# EAGLE schematic ws2812b-board (EAGLE 6.5.0)
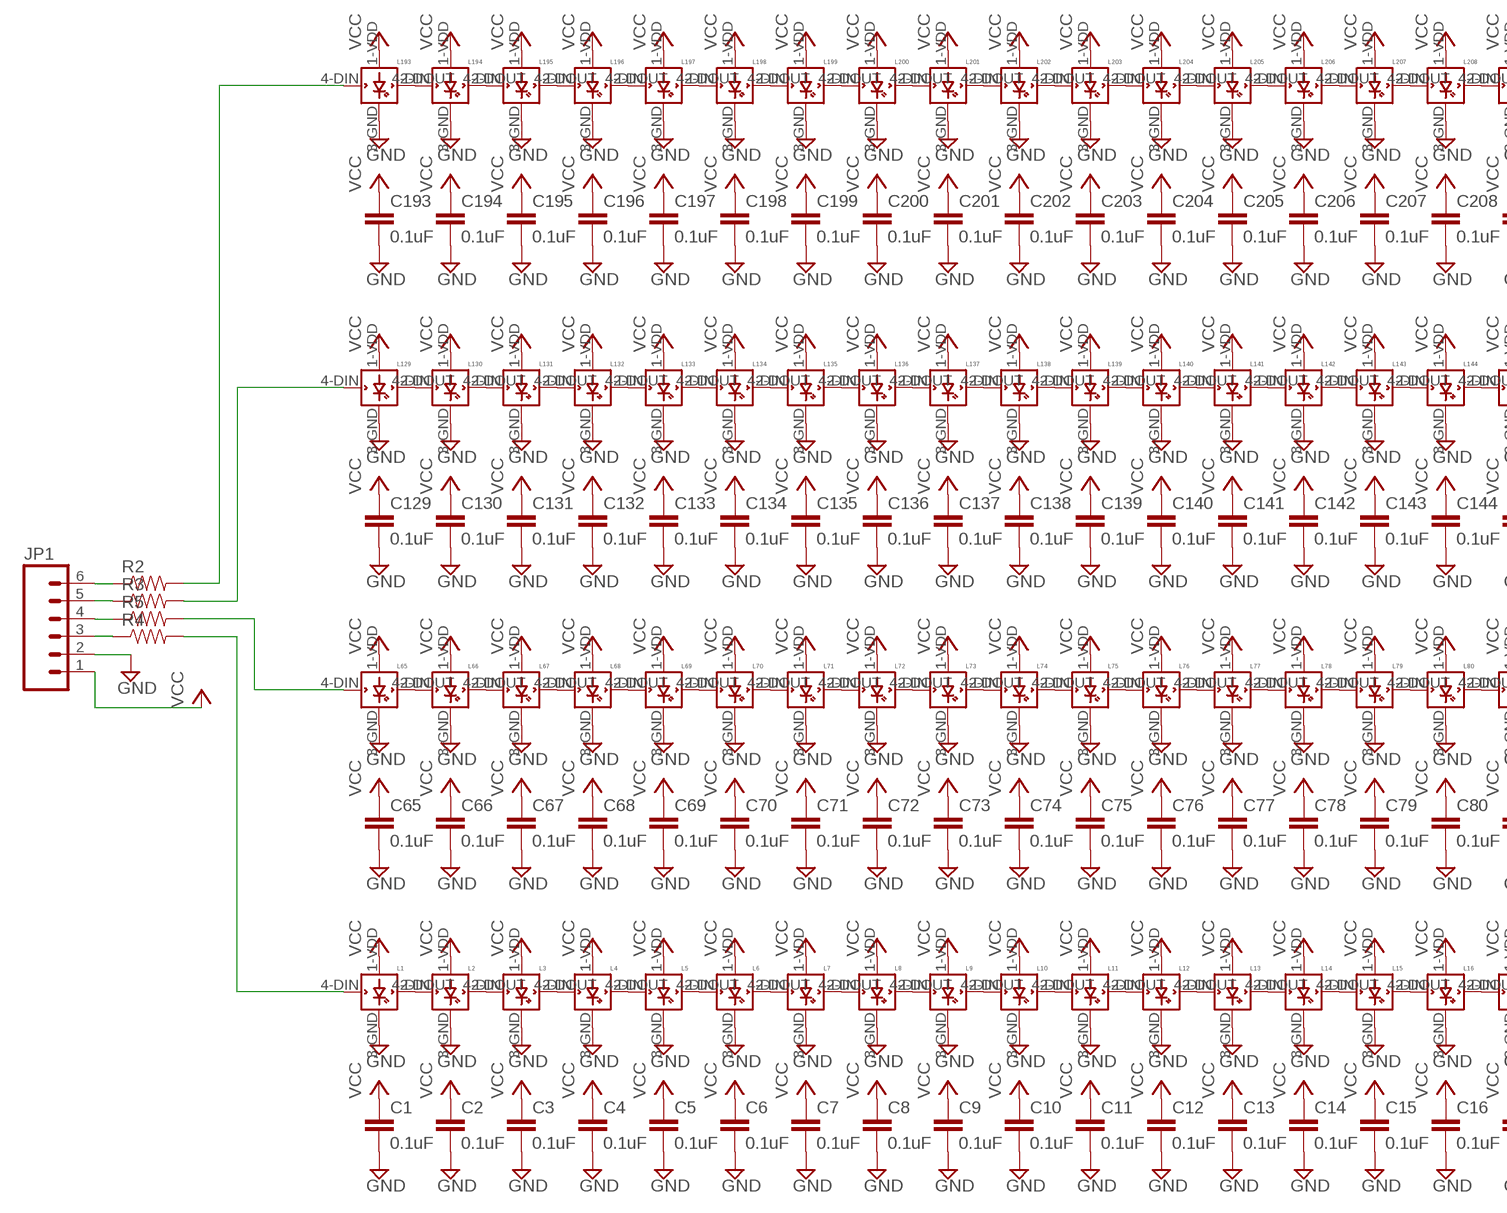
[diagram p0: schematic, sheet 1, part 1 of 2]
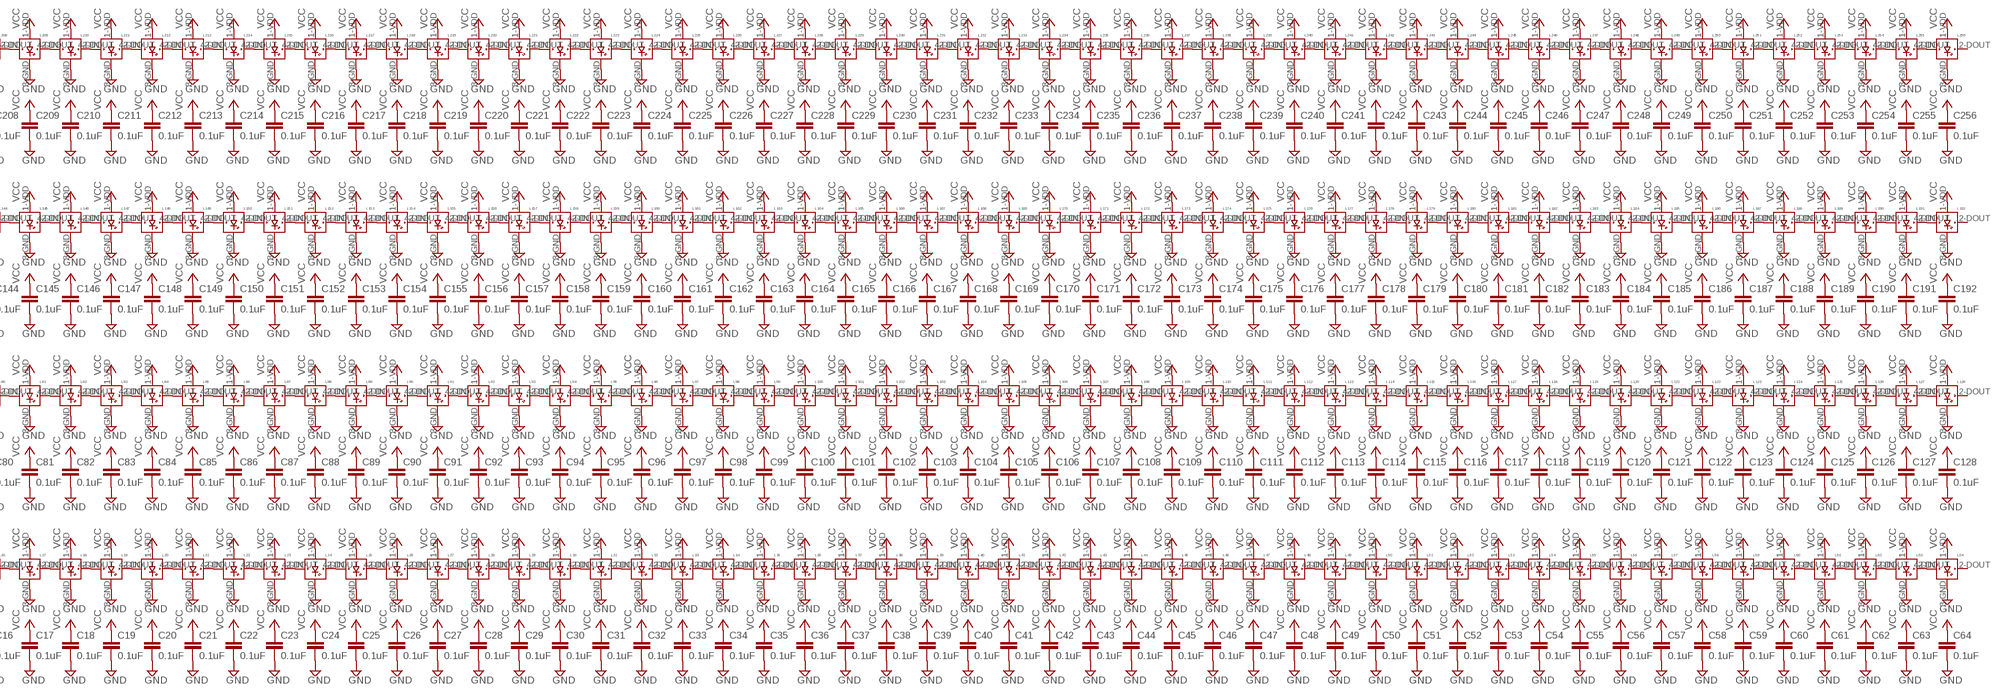
[diagram p1: schematic, sheet 1, part 2 of 2]

## Parts
C1  0.1uF  CAP0603-CAP  [0603-CAP]
C2  0.1uF  CAP0603-CAP  [0603-CAP]
C3  0.1uF  CAP0603-CAP  [0603-CAP]
C4  0.1uF  CAP0603-CAP  [0603-CAP]
C5  0.1uF  CAP0603-CAP  [0603-CAP]
C6  0.1uF  CAP0603-CAP  [0603-CAP]
C7  0.1uF  CAP0603-CAP  [0603-CAP]
C8  0.1uF  CAP0603-CAP  [0603-CAP]
C9  0.1uF  CAP0603-CAP  [0603-CAP]
C10  0.1uF  CAP0603-CAP  [0603-CAP]
C11  0.1uF  CAP0603-CAP  [0603-CAP]
C12  0.1uF  CAP0603-CAP  [0603-CAP]
C13  0.1uF  CAP0603-CAP  [0603-CAP]
C14  0.1uF  CAP0603-CAP  [0603-CAP]
C15  0.1uF  CAP0603-CAP  [0603-CAP]
C16  0.1uF  CAP0603-CAP  [0603-CAP]
C17  0.1uF  CAP0603-CAP  [0603-CAP]
C18  0.1uF  CAP0603-CAP  [0603-CAP]
C19  0.1uF  CAP0603-CAP  [0603-CAP]
C20  0.1uF  CAP0603-CAP  [0603-CAP]
C21  0.1uF  CAP0603-CAP  [0603-CAP]
C22  0.1uF  CAP0603-CAP  [0603-CAP]
C23  0.1uF  CAP0603-CAP  [0603-CAP]
C24  0.1uF  CAP0603-CAP  [0603-CAP]
C25  0.1uF  CAP0603-CAP  [0603-CAP]
C26  0.1uF  CAP0603-CAP  [0603-CAP]
C27  0.1uF  CAP0603-CAP  [0603-CAP]
C28  0.1uF  CAP0603-CAP  [0603-CAP]
C29  0.1uF  CAP0603-CAP  [0603-CAP]
C30  0.1uF  CAP0603-CAP  [0603-CAP]
C31  0.1uF  CAP0603-CAP  [0603-CAP]
C32  0.1uF  CAP0603-CAP  [0603-CAP]
C33  0.1uF  CAP0603-CAP  [0603-CAP]
C34  0.1uF  CAP0603-CAP  [0603-CAP]
C35  0.1uF  CAP0603-CAP  [0603-CAP]
C36  0.1uF  CAP0603-CAP  [0603-CAP]
C37  0.1uF  CAP0603-CAP  [0603-CAP]
C38  0.1uF  CAP0603-CAP  [0603-CAP]
C39  0.1uF  CAP0603-CAP  [0603-CAP]
C40  0.1uF  CAP0603-CAP  [0603-CAP]
C41  0.1uF  CAP0603-CAP  [0603-CAP]
C42  0.1uF  CAP0603-CAP  [0603-CAP]
C43  0.1uF  CAP0603-CAP  [0603-CAP]
C44  0.1uF  CAP0603-CAP  [0603-CAP]
C45  0.1uF  CAP0603-CAP  [0603-CAP]
C46  0.1uF  CAP0603-CAP  [0603-CAP]
C47  0.1uF  CAP0603-CAP  [0603-CAP]
C48  0.1uF  CAP0603-CAP  [0603-CAP]
C49  0.1uF  CAP0603-CAP  [0603-CAP]
C50  0.1uF  CAP0603-CAP  [0603-CAP]
C51  0.1uF  CAP0603-CAP  [0603-CAP]
C52  0.1uF  CAP0603-CAP  [0603-CAP]
C53  0.1uF  CAP0603-CAP  [0603-CAP]
C54  0.1uF  CAP0603-CAP  [0603-CAP]
C55  0.1uF  CAP0603-CAP  [0603-CAP]
C56  0.1uF  CAP0603-CAP  [0603-CAP]
C57  0.1uF  CAP0603-CAP  [0603-CAP]
C58  0.1uF  CAP0603-CAP  [0603-CAP]
C59  0.1uF  CAP0603-CAP  [0603-CAP]
C60  0.1uF  CAP0603-CAP  [0603-CAP]
C61  0.1uF  CAP0603-CAP  [0603-CAP]
C62  0.1uF  CAP0603-CAP  [0603-CAP]
C63  0.1uF  CAP0603-CAP  [0603-CAP]
C64  0.1uF  CAP0603-CAP  [0603-CAP]
C65  0.1uF  CAP0603-CAP  [0603-CAP]
C66  0.1uF  CAP0603-CAP  [0603-CAP]
C67  0.1uF  CAP0603-CAP  [0603-CAP]
C68  0.1uF  CAP0603-CAP  [0603-CAP]
C69  0.1uF  CAP0603-CAP  [0603-CAP]
C70  0.1uF  CAP0603-CAP  [0603-CAP]
C71  0.1uF  CAP0603-CAP  [0603-CAP]
C72  0.1uF  CAP0603-CAP  [0603-CAP]
C73  0.1uF  CAP0603-CAP  [0603-CAP]
C74  0.1uF  CAP0603-CAP  [0603-CAP]
C75  0.1uF  CAP0603-CAP  [0603-CAP]
C76  0.1uF  CAP0603-CAP  [0603-CAP]
C77  0.1uF  CAP0603-CAP  [0603-CAP]
C78  0.1uF  CAP0603-CAP  [0603-CAP]
C79  0.1uF  CAP0603-CAP  [0603-CAP]
C80  0.1uF  CAP0603-CAP  [0603-CAP]
C81  0.1uF  CAP0603-CAP  [0603-CAP]
C82  0.1uF  CAP0603-CAP  [0603-CAP]
C83  0.1uF  CAP0603-CAP  [0603-CAP]
C84  0.1uF  CAP0603-CAP  [0603-CAP]
C85  0.1uF  CAP0603-CAP  [0603-CAP]
C86  0.1uF  CAP0603-CAP  [0603-CAP]
C87  0.1uF  CAP0603-CAP  [0603-CAP]
C88  0.1uF  CAP0603-CAP  [0603-CAP]
C89  0.1uF  CAP0603-CAP  [0603-CAP]
C90  0.1uF  CAP0603-CAP  [0603-CAP]
C91  0.1uF  CAP0603-CAP  [0603-CAP]
C92  0.1uF  CAP0603-CAP  [0603-CAP]
C93  0.1uF  CAP0603-CAP  [0603-CAP]
C94  0.1uF  CAP0603-CAP  [0603-CAP]
C95  0.1uF  CAP0603-CAP  [0603-CAP]
C96  0.1uF  CAP0603-CAP  [0603-CAP]
C97  0.1uF  CAP0603-CAP  [0603-CAP]
C98  0.1uF  CAP0603-CAP  [0603-CAP]
C99  0.1uF  CAP0603-CAP  [0603-CAP]
C100  0.1uF  CAP0603-CAP  [0603-CAP]
C101  0.1uF  CAP0603-CAP  [0603-CAP]
C102  0.1uF  CAP0603-CAP  [0603-CAP]
C103  0.1uF  CAP0603-CAP  [0603-CAP]
C104  0.1uF  CAP0603-CAP  [0603-CAP]
C105  0.1uF  CAP0603-CAP  [0603-CAP]
C106  0.1uF  CAP0603-CAP  [0603-CAP]
C107  0.1uF  CAP0603-CAP  [0603-CAP]
C108  0.1uF  CAP0603-CAP  [0603-CAP]
C109  0.1uF  CAP0603-CAP  [0603-CAP]
C110  0.1uF  CAP0603-CAP  [0603-CAP]
C111  0.1uF  CAP0603-CAP  [0603-CAP]
C112  0.1uF  CAP0603-CAP  [0603-CAP]
C113  0.1uF  CAP0603-CAP  [0603-CAP]
C114  0.1uF  CAP0603-CAP  [0603-CAP]
C115  0.1uF  CAP0603-CAP  [0603-CAP]
C116  0.1uF  CAP0603-CAP  [0603-CAP]
C117  0.1uF  CAP0603-CAP  [0603-CAP]
C118  0.1uF  CAP0603-CAP  [0603-CAP]
C119  0.1uF  CAP0603-CAP  [0603-CAP]
C120  0.1uF  CAP0603-CAP  [0603-CAP]
C121  0.1uF  CAP0603-CAP  [0603-CAP]
C122  0.1uF  CAP0603-CAP  [0603-CAP]
C123  0.1uF  CAP0603-CAP  [0603-CAP]
C124  0.1uF  CAP0603-CAP  [0603-CAP]
C125  0.1uF  CAP0603-CAP  [0603-CAP]
C126  0.1uF  CAP0603-CAP  [0603-CAP]
C127  0.1uF  CAP0603-CAP  [0603-CAP]
C128  0.1uF  CAP0603-CAP  [0603-CAP]
C129  0.1uF  CAP0603-CAP  [0603-CAP]
C130  0.1uF  CAP0603-CAP  [0603-CAP]
C131  0.1uF  CAP0603-CAP  [0603-CAP]
C132  0.1uF  CAP0603-CAP  [0603-CAP]
C133  0.1uF  CAP0603-CAP  [0603-CAP]
C134  0.1uF  CAP0603-CAP  [0603-CAP]
C135  0.1uF  CAP0603-CAP  [0603-CAP]
C136  0.1uF  CAP0603-CAP  [0603-CAP]
C137  0.1uF  CAP0603-CAP  [0603-CAP]
C138  0.1uF  CAP0603-CAP  [0603-CAP]
C139  0.1uF  CAP0603-CAP  [0603-CAP]
C140  0.1uF  CAP0603-CAP  [0603-CAP]
C141  0.1uF  CAP0603-CAP  [0603-CAP]
C142  0.1uF  CAP0603-CAP  [0603-CAP]
C143  0.1uF  CAP0603-CAP  [0603-CAP]
C144  0.1uF  CAP0603-CAP  [0603-CAP]
C145  0.1uF  CAP0603-CAP  [0603-CAP]
C146  0.1uF  CAP0603-CAP  [0603-CAP]
C147  0.1uF  CAP0603-CAP  [0603-CAP]
C148  0.1uF  CAP0603-CAP  [0603-CAP]
C149  0.1uF  CAP0603-CAP  [0603-CAP]
C150  0.1uF  CAP0603-CAP  [0603-CAP]
C151  0.1uF  CAP0603-CAP  [0603-CAP]
C152  0.1uF  CAP0603-CAP  [0603-CAP]
C153  0.1uF  CAP0603-CAP  [0603-CAP]
C154  0.1uF  CAP0603-CAP  [0603-CAP]
C155  0.1uF  CAP0603-CAP  [0603-CAP]
C156  0.1uF  CAP0603-CAP  [0603-CAP]
C157  0.1uF  CAP0603-CAP  [0603-CAP]
C158  0.1uF  CAP0603-CAP  [0603-CAP]
C159  0.1uF  CAP0603-CAP  [0603-CAP]
C160  0.1uF  CAP0603-CAP  [0603-CAP]
C161  0.1uF  CAP0603-CAP  [0603-CAP]
C162  0.1uF  CAP0603-CAP  [0603-CAP]
C163  0.1uF  CAP0603-CAP  [0603-CAP]
C164  0.1uF  CAP0603-CAP  [0603-CAP]
C165  0.1uF  CAP0603-CAP  [0603-CAP]
C166  0.1uF  CAP0603-CAP  [0603-CAP]
C167  0.1uF  CAP0603-CAP  [0603-CAP]
C168  0.1uF  CAP0603-CAP  [0603-CAP]
C169  0.1uF  CAP0603-CAP  [0603-CAP]
C170  0.1uF  CAP0603-CAP  [0603-CAP]
C171  0.1uF  CAP0603-CAP  [0603-CAP]
C172  0.1uF  CAP0603-CAP  [0603-CAP]
C173  0.1uF  CAP0603-CAP  [0603-CAP]
C174  0.1uF  CAP0603-CAP  [0603-CAP]
C175  0.1uF  CAP0603-CAP  [0603-CAP]
C176  0.1uF  CAP0603-CAP  [0603-CAP]
C177  0.1uF  CAP0603-CAP  [0603-CAP]
C178  0.1uF  CAP0603-CAP  [0603-CAP]
C179  0.1uF  CAP0603-CAP  [0603-CAP]
C180  0.1uF  CAP0603-CAP  [0603-CAP]
C181  0.1uF  CAP0603-CAP  [0603-CAP]
C182  0.1uF  CAP0603-CAP  [0603-CAP]
C183  0.1uF  CAP0603-CAP  [0603-CAP]
C184  0.1uF  CAP0603-CAP  [0603-CAP]
C185  0.1uF  CAP0603-CAP  [0603-CAP]
C186  0.1uF  CAP0603-CAP  [0603-CAP]
C187  0.1uF  CAP0603-CAP  [0603-CAP]
C188  0.1uF  CAP0603-CAP  [0603-CAP]
C189  0.1uF  CAP0603-CAP  [0603-CAP]
C190  0.1uF  CAP0603-CAP  [0603-CAP]
C191  0.1uF  CAP0603-CAP  [0603-CAP]
C192  0.1uF  CAP0603-CAP  [0603-CAP]
C193  0.1uF  CAP0603-CAP  [0603-CAP]
C194  0.1uF  CAP0603-CAP  [0603-CAP]
C195  0.1uF  CAP0603-CAP  [0603-CAP]
C196  0.1uF  CAP0603-CAP  [0603-CAP]
C197  0.1uF  CAP0603-CAP  [0603-CAP]
C198  0.1uF  CAP0603-CAP  [0603-CAP]
C199  0.1uF  CAP0603-CAP  [0603-CAP]
C200  0.1uF  CAP0603-CAP  [0603-CAP]
C201  0.1uF  CAP0603-CAP  [0603-CAP]
C202  0.1uF  CAP0603-CAP  [0603-CAP]
C203  0.1uF  CAP0603-CAP  [0603-CAP]
C204  0.1uF  CAP0603-CAP  [0603-CAP]
C205  0.1uF  CAP0603-CAP  [0603-CAP]
C206  0.1uF  CAP0603-CAP  [0603-CAP]
C207  0.1uF  CAP0603-CAP  [0603-CAP]
C208  0.1uF  CAP0603-CAP  [0603-CAP]
C209  0.1uF  CAP0603-CAP  [0603-CAP]
C210  0.1uF  CAP0603-CAP  [0603-CAP]
C211  0.1uF  CAP0603-CAP  [0603-CAP]
C212  0.1uF  CAP0603-CAP  [0603-CAP]
C213  0.1uF  CAP0603-CAP  [0603-CAP]
C214  0.1uF  CAP0603-CAP  [0603-CAP]
C215  0.1uF  CAP0603-CAP  [0603-CAP]
C216  0.1uF  CAP0603-CAP  [0603-CAP]
C217  0.1uF  CAP0603-CAP  [0603-CAP]
C218  0.1uF  CAP0603-CAP  [0603-CAP]
C219  0.1uF  CAP0603-CAP  [0603-CAP]
C220  0.1uF  CAP0603-CAP  [0603-CAP]
C221  0.1uF  CAP0603-CAP  [0603-CAP]
C222  0.1uF  CAP0603-CAP  [0603-CAP]
C223  0.1uF  CAP0603-CAP  [0603-CAP]
C224  0.1uF  CAP0603-CAP  [0603-CAP]
C225  0.1uF  CAP0603-CAP  [0603-CAP]
C226  0.1uF  CAP0603-CAP  [0603-CAP]
C227  0.1uF  CAP0603-CAP  [0603-CAP]
C228  0.1uF  CAP0603-CAP  [0603-CAP]
C229  0.1uF  CAP0603-CAP  [0603-CAP]
C230  0.1uF  CAP0603-CAP  [0603-CAP]
C231  0.1uF  CAP0603-CAP  [0603-CAP]
C232  0.1uF  CAP0603-CAP  [0603-CAP]
C233  0.1uF  CAP0603-CAP  [0603-CAP]
C234  0.1uF  CAP0603-CAP  [0603-CAP]
C235  0.1uF  CAP0603-CAP  [0603-CAP]
C236  0.1uF  CAP0603-CAP  [0603-CAP]
C237  0.1uF  CAP0603-CAP  [0603-CAP]
C238  0.1uF  CAP0603-CAP  [0603-CAP]
C239  0.1uF  CAP0603-CAP  [0603-CAP]
C240  0.1uF  CAP0603-CAP  [0603-CAP]
C241  0.1uF  CAP0603-CAP  [0603-CAP]
C242  0.1uF  CAP0603-CAP  [0603-CAP]
C243  0.1uF  CAP0603-CAP  [0603-CAP]
C244  0.1uF  CAP0603-CAP  [0603-CAP]
C245  0.1uF  CAP0603-CAP  [0603-CAP]
C246  0.1uF  CAP0603-CAP  [0603-CAP]
C247  0.1uF  CAP0603-CAP  [0603-CAP]
C248  0.1uF  CAP0603-CAP  [0603-CAP]
C249  0.1uF  CAP0603-CAP  [0603-CAP]
C250  0.1uF  CAP0603-CAP  [0603-CAP]
C251  0.1uF  CAP0603-CAP  [0603-CAP]
C252  0.1uF  CAP0603-CAP  [0603-CAP]
C253  0.1uF  CAP0603-CAP  [0603-CAP]
C254  0.1uF  CAP0603-CAP  [0603-CAP]
C255  0.1uF  CAP0603-CAP  [0603-CAP]
C256  0.1uF  CAP0603-CAP  [0603-CAP]
JP1  M06SIP  [1X06]
L1  WS2812B  [WS2812B]
L2  WS2812B  [WS2812B]
L3  WS2812B  [WS2812B]
L4  WS2812B  [WS2812B]
L5  WS2812B  [WS2812B]
L6  WS2812B  [WS2812B]
L7  WS2812B  [WS2812B]
L8  WS2812B  [WS2812B]
L9  WS2812B  [WS2812B]
L10  WS2812B  [WS2812B]
L11  WS2812B  [WS2812B]
L12  WS2812B  [WS2812B]
L13  WS2812B  [WS2812B]
L14  WS2812B  [WS2812B]
L15  WS2812B  [WS2812B]
L16  WS2812B  [WS2812B]
L17  WS2812B  [WS2812B]
L18  WS2812B  [WS2812B]
L19  WS2812B  [WS2812B]
L20  WS2812B  [WS2812B]
L21  WS2812B  [WS2812B]
L22  WS2812B  [WS2812B]
L23  WS2812B  [WS2812B]
L24  WS2812B  [WS2812B]
L25  WS2812B  [WS2812B]
L26  WS2812B  [WS2812B]
L27  WS2812B  [WS2812B]
L28  WS2812B  [WS2812B]
L29  WS2812B  [WS2812B]
L30  WS2812B  [WS2812B]
L31  WS2812B  [WS2812B]
L32  WS2812B  [WS2812B]
L33  WS2812B  [WS2812B]
L34  WS2812B  [WS2812B]
L35  WS2812B  [WS2812B]
L36  WS2812B  [WS2812B]
L37  WS2812B  [WS2812B]
L38  WS2812B  [WS2812B]
L39  WS2812B  [WS2812B]
L40  WS2812B  [WS2812B]
L41  WS2812B  [WS2812B]
L42  WS2812B  [WS2812B]
L43  WS2812B  [WS2812B]
L44  WS2812B  [WS2812B]
L45  WS2812B  [WS2812B]
L46  WS2812B  [WS2812B]
L47  WS2812B  [WS2812B]
L48  WS2812B  [WS2812B]
L49  WS2812B  [WS2812B]
L50  WS2812B  [WS2812B]
L51  WS2812B  [WS2812B]
L52  WS2812B  [WS2812B]
L53  WS2812B  [WS2812B]
L54  WS2812B  [WS2812B]
L55  WS2812B  [WS2812B]
L56  WS2812B  [WS2812B]
L57  WS2812B  [WS2812B]
L58  WS2812B  [WS2812B]
L59  WS2812B  [WS2812B]
L60  WS2812B  [WS2812B]
L61  WS2812B  [WS2812B]
L62  WS2812B  [WS2812B]
L63  WS2812B  [WS2812B]
L64  WS2812B  [WS2812B]
L65  WS2812B  [WS2812B]
L66  WS2812B  [WS2812B]
L67  WS2812B  [WS2812B]
L68  WS2812B  [WS2812B]
L69  WS2812B  [WS2812B]
L70  WS2812B  [WS2812B]
L71  WS2812B  [WS2812B]
L72  WS2812B  [WS2812B]
L73  WS2812B  [WS2812B]
L74  WS2812B  [WS2812B]
L75  WS2812B  [WS2812B]
L76  WS2812B  [WS2812B]
L77  WS2812B  [WS2812B]
L78  WS2812B  [WS2812B]
L79  WS2812B  [WS2812B]
L80  WS2812B  [WS2812B]
L81  WS2812B  [WS2812B]
L82  WS2812B  [WS2812B]
L83  WS2812B  [WS2812B]
L84  WS2812B  [WS2812B]
L85  WS2812B  [WS2812B]
L86  WS2812B  [WS2812B]
L87  WS2812B  [WS2812B]
L88  WS2812B  [WS2812B]
L89  WS2812B  [WS2812B]
L90  WS2812B  [WS2812B]
L91  WS2812B  [WS2812B]
L92  WS2812B  [WS2812B]
L93  WS2812B  [WS2812B]
L94  WS2812B  [WS2812B]
L95  WS2812B  [WS2812B]
L96  WS2812B  [WS2812B]
L97  WS2812B  [WS2812B]
L98  WS2812B  [WS2812B]
L99  WS2812B  [WS2812B]
L100  WS2812B  [WS2812B]
L101  WS2812B  [WS2812B]
L102  WS2812B  [WS2812B]
L103  WS2812B  [WS2812B]
L104  WS2812B  [WS2812B]
L105  WS2812B  [WS2812B]
L106  WS2812B  [WS2812B]
L107  WS2812B  [WS2812B]
L108  WS2812B  [WS2812B]
L109  WS2812B  [WS2812B]
L110  WS2812B  [WS2812B]
L111  WS2812B  [WS2812B]
L112  WS2812B  [WS2812B]
L113  WS2812B  [WS2812B]
L114  WS2812B  [WS2812B]
L115  WS2812B  [WS2812B]
L116  WS2812B  [WS2812B]
L117  WS2812B  [WS2812B]
L118  WS2812B  [WS2812B]
L119  WS2812B  [WS2812B]
L120  WS2812B  [WS2812B]
L121  WS2812B  [WS2812B]
L122  WS2812B  [WS2812B]
L123  WS2812B  [WS2812B]
L124  WS2812B  [WS2812B]
L125  WS2812B  [WS2812B]
L126  WS2812B  [WS2812B]
L127  WS2812B  [WS2812B]
L128  WS2812B  [WS2812B]
L129  WS2812B  [WS2812B]
L130  WS2812B  [WS2812B]
L131  WS2812B  [WS2812B]
L132  WS2812B  [WS2812B]
L133  WS2812B  [WS2812B]
L134  WS2812B  [WS2812B]
L135  WS2812B  [WS2812B]
L136  WS2812B  [WS2812B]
L137  WS2812B  [WS2812B]
L138  WS2812B  [WS2812B]
L139  WS2812B  [WS2812B]
L140  WS2812B  [WS2812B]
L141  WS2812B  [WS2812B]
L142  WS2812B  [WS2812B]
L143  WS2812B  [WS2812B]
L144  WS2812B  [WS2812B]
L145  WS2812B  [WS2812B]
L146  WS2812B  [WS2812B]
L147  WS2812B  [WS2812B]
L148  WS2812B  [WS2812B]
L149  WS2812B  [WS2812B]
L150  WS2812B  [WS2812B]
L151  WS2812B  [WS2812B]
L152  WS2812B  [WS2812B]
L153  WS2812B  [WS2812B]
L154  WS2812B  [WS2812B]
L155  WS2812B  [WS2812B]
L156  WS2812B  [WS2812B]
L157  WS2812B  [WS2812B]
L158  WS2812B  [WS2812B]
L159  WS2812B  [WS2812B]
L160  WS2812B  [WS2812B]
L161  WS2812B  [WS2812B]
L162  WS2812B  [WS2812B]
L163  WS2812B  [WS2812B]
L164  WS2812B  [WS2812B]
L165  WS2812B  [WS2812B]
L166  WS2812B  [WS2812B]
L167  WS2812B  [WS2812B]
L168  WS2812B  [WS2812B]
L169  WS2812B  [WS2812B]
L170  WS2812B  [WS2812B]
L171  WS2812B  [WS2812B]
L172  WS2812B  [WS2812B]
L173  WS2812B  [WS2812B]
L174  WS2812B  [WS2812B]
L175  WS2812B  [WS2812B]
L176  WS2812B  [WS2812B]
L177  WS2812B  [WS2812B]
L178  WS2812B  [WS2812B]
L179  WS2812B  [WS2812B]
L180  WS2812B  [WS2812B]
L181  WS2812B  [WS2812B]
L182  WS2812B  [WS2812B]
L183  WS2812B  [WS2812B]
L184  WS2812B  [WS2812B]
L185  WS2812B  [WS2812B]
L186  WS2812B  [WS2812B]
L187  WS2812B  [WS2812B]
L188  WS2812B  [WS2812B]
L189  WS2812B  [WS2812B]
L190  WS2812B  [WS2812B]
L191  WS2812B  [WS2812B]
L192  WS2812B  [WS2812B]
L193  WS2812B  [WS2812B]
L194  WS2812B  [WS2812B]
L195  WS2812B  [WS2812B]
L196  WS2812B  [WS2812B]
L197  WS2812B  [WS2812B]
L198  WS2812B  [WS2812B]
L199  WS2812B  [WS2812B]
L200  WS2812B  [WS2812B]
L201  WS2812B  [WS2812B]
L202  WS2812B  [WS2812B]
L203  WS2812B  [WS2812B]
L204  WS2812B  [WS2812B]
L205  WS2812B  [WS2812B]
L206  WS2812B  [WS2812B]
L207  WS2812B  [WS2812B]
L208  WS2812B  [WS2812B]
L209  WS2812B  [WS2812B]
L210  WS2812B  [WS2812B]
L211  WS2812B  [WS2812B]
L212  WS2812B  [WS2812B]
L213  WS2812B  [WS2812B]
L214  WS2812B  [WS2812B]
L215  WS2812B  [WS2812B]
L216  WS2812B  [WS2812B]
L217  WS2812B  [WS2812B]
L218  WS2812B  [WS2812B]
L219  WS2812B  [WS2812B]
L220  WS2812B  [WS2812B]
L221  WS2812B  [WS2812B]
L222  WS2812B  [WS2812B]
L223  WS2812B  [WS2812B]
L224  WS2812B  [WS2812B]
L225  WS2812B  [WS2812B]
L226  WS2812B  [WS2812B]
L227  WS2812B  [WS2812B]
L228  WS2812B  [WS2812B]
L229  WS2812B  [WS2812B]
L230  WS2812B  [WS2812B]
L231  WS2812B  [WS2812B]
L232  WS2812B  [WS2812B]
L233  WS2812B  [WS2812B]
L234  WS2812B  [WS2812B]
L235  WS2812B  [WS2812B]
L236  WS2812B  [WS2812B]
L237  WS2812B  [WS2812B]
L238  WS2812B  [WS2812B]
L239  WS2812B  [WS2812B]
L240  WS2812B  [WS2812B]
L241  WS2812B  [WS2812B]
L242  WS2812B  [WS2812B]
L243  WS2812B  [WS2812B]
L244  WS2812B  [WS2812B]
L245  WS2812B  [WS2812B]
L246  WS2812B  [WS2812B]
L247  WS2812B  [WS2812B]
L248  WS2812B  [WS2812B]
L249  WS2812B  [WS2812B]
L250  WS2812B  [WS2812B]
L251  WS2812B  [WS2812B]
L252  WS2812B  [WS2812B]
L253  WS2812B  [WS2812B]
L254  WS2812B  [WS2812B]
L255  WS2812B  [WS2812B]
L256  WS2812B  [WS2812B]
R2  RESISTOR0805-RES  [0805]
R3  RESISTOR0805-RES  [0805]
R4  RESISTOR0805-RES  [0805]
R5  RESISTOR0805-RES  [0805]

## Nets
GND: C1.2 C2.2 C3.2 C4.2 C5.2 C6.2 C7.2 C8.2 C9.2 C10.2 C11.2 C12.2 C13.2 C14.2 C15.2 C16.2 C17.2 C18.2 C19.2 C20.2 C21.2 C22.2 C23.2 C24.2 C25.2 C26.2 C27.2 C28.2 C29.2 C30.2 C31.2 C32.2 C33.2 C34.2 C35.2 C36.2 C37.2 C38.2 C39.2 C40.2 C41.2 C42.2 C43.2 C44.2 C45.2 C46.2 C47.2 C48.2 C49.2 C50.2 C51.2 C52.2 C53.2 C54.2 C55.2 C56.2 C57.2 C58.2 C59.2 C60.2 C61.2 C62.2 C63.2 C64.2 C65.2 C66.2 C67.2 C68.2 C69.2 C70.2 C71.2 C72.2 C73.2 C74.2 C75.2 C76.2 C77.2 C78.2 C79.2 C80.2 C81.2 C82.2 C83.2 C84.2 C85.2 C86.2 C87.2 C88.2 C89.2 C90.2 C91.2 C92.2 C93.2 C94.2 C95.2 C96.2 C97.2 C98.2 C99.2 C100.2 C101.2 C102.2 C103.2 C104.2 C105.2 C106.2 C107.2 C108.2 C109.2 C110.2 C111.2 C112.2 C113.2 C114.2 C115.2 C116.2 C117.2 C118.2 C119.2 C120.2 C121.2 C122.2 C123.2 C124.2 C125.2 C126.2 C127.2 C128.2 C129.2 C130.2 C131.2 C132.2 C133.2 C134.2 C135.2 C136.2 C137.2 C138.2 C139.2 C140.2 C141.2 C142.2 C143.2 C144.2 C145.2 C146.2 C147.2 C148.2 C149.2 C150.2 C151.2 C152.2 C153.2 C154.2 C155.2 C156.2 C157.2 C158.2 C159.2 C160.2 C161.2 C162.2 C163.2 C164.2 C165.2 C166.2 C167.2 C168.2 C169.2 C170.2 C171.2 C172.2 C173.2 C174.2 C175.2 C176.2 C177.2 C178.2 C179.2 C180.2 C181.2 C182.2 C183.2 C184.2 C185.2 C186.2 C187.2 C188.2 C189.2 C190.2 C191.2 C192.2 C193.2 C194.2 C195.2 C196.2 C197.2 C198.2 C199.2 C200.2 C201.2 C202.2 C203.2 C204.2 C205.2 C206.2 C207.2 C208.2 C209.2 C210.2 C211.2 C212.2 C213.2 C214.2 C215.2 C216.2 C217.2 C218.2 C219.2 C220.2 C221.2 C222.2 C223.2 C224.2 C225.2 C226.2 C227.2 C228.2 C229.2 C230.2 C231.2 C232.2 C233.2 C234.2 C235.2 C236.2 C237.2 C238.2 C239.2 C240.2 C241.2 C242.2 C243.2 C244.2 C245.2 C246.2 C247.2 C248.2 C249.2 C250.2 C251.2 C252.2 C253.2 C254.2 C255.2 C256.2 JP1.2 L1.3-GND(GND) L2.3-GND(GND) L3.3-GND(GND) L4.3-GND(GND) L5.3-GND(GND) L6.3-GND(GND) L7.3-GND(GND) L8.3-GND(GND) L9.3-GND(GND) L10.3-GND(GND) L11.3-GND(GND) L12.3-GND(GND) L13.3-GND(GND) L14.3-GND(GND) L15.3-GND(GND) L16.3-GND(GND) L17.3-GND(GND) L18.3-GND(GND) L19.3-GND(GND) L20.3-GND(GND) L21.3-GND(GND) L22.3-GND(GND) L23.3-GND(GND) L24.3-GND(GND) L25.3-GND(GND) L26.3-GND(GND) L27.3-GND(GND) L28.3-GND(GND) L29.3-GND(GND) L30.3-GND(GND) L31.3-GND(GND) L32.3-GND(GND) L33.3-GND(GND) L34.3-GND(GND) L35.3-GND(GND) L36.3-GND(GND) L37.3-GND(GND) L38.3-GND(GND) L39.3-GND(GND) L40.3-GND(GND) L41.3-GND(GND) L42.3-GND(GND) L43.3-GND(GND) L44.3-GND(GND) L45.3-GND(GND) L46.3-GND(GND) L47.3-GND(GND) L48.3-GND(GND) L49.3-GND(GND) L50.3-GND(GND) L51.3-GND(GND) L52.3-GND(GND) L53.3-GND(GND) L54.3-GND(GND) L55.3-GND(GND) L56.3-GND(GND) L57.3-GND(GND) L58.3-GND(GND) L59.3-GND(GND) L60.3-GND(GND) L61.3-GND(GND) L62.3-GND(GND) L63.3-GND(GND) L64.3-GND(GND) L65.3-GND(GND) L66.3-GND(GND) L67.3-GND(GND) L68.3-GND(GND) L69.3-GND(GND) L70.3-GND(GND) L71.3-GND(GND) L72.3-GND(GND) L73.3-GND(GND) L74.3-GND(GND) L75.3-GND(GND) L76.3-GND(GND) L77.3-GND(GND) L78.3-GND(GND) L79.3-GND(GND) L80.3-GND(GND) L81.3-GND(GND) L82.3-GND(GND) L83.3-GND(GND) L84.3-GND(GND) L85.3-GND(GND) L86.3-GND(GND) L87.3-GND(GND) L88.3-GND(GND) L89.3-GND(GND) L90.3-GND(GND) L91.3-GND(GND) L92.3-GND(GND) L93.3-GND(GND) L94.3-GND(GND) L95.3-GND(GND) L96.3-GND(GND) L97.3-GND(GND) L98.3-GND(GND) L99.3-GND(GND) L100.3-GND(GND) L101.3-GND(GND) L102.3-GND(GND) L103.3-GND(GND) L104.3-GND(GND) L105.3-GND(GND) L106.3-GND(GND) L107.3-GND(GND) L108.3-GND(GND) L109.3-GND(GND) L110.3-GND(GND) L111.3-GND(GND) L112.3-GND(GND) L113.3-GND(GND) L114.3-GND(GND) L115.3-GND(GND) L116.3-GND(GND) L117.3-GND(GND) L118.3-GND(GND) L119.3-GND(GND) L120.3-GND(GND) L121.3-GND(GND) L122.3-GND(GND) L123.3-GND(GND) L124.3-GND(GND) L125.3-GND(GND) L126.3-GND(GND) L127.3-GND(GND) L128.3-GND(GND) L129.3-GND(GND) L130.3-GND(GND) L131.3-GND(GND) L132.3-GND(GND) L133.3-GND(GND) L134.3-GND(GND) L135.3-GND(GND) L136.3-GND(GND) L137.3-GND(GND) L138.3-GND(GND) L139.3-GND(GND) L140.3-GND(GND) L141.3-GND(GND) L142.3-GND(GND) L143.3-GND(GND) L144.3-GND(GND) L145.3-GND(GND) L146.3-GND(GND) L147.3-GND(GND) L148.3-GND(GND) L149.3-GND(GND) L150.3-GND(GND) L151.3-GND(GND) L152.3-GND(GND) L153.3-GND(GND) L154.3-GND(GND) L155.3-GND(GND) L156.3-GND(GND) L157.3-GND(GND) L158.3-GND(GND) L159.3-GND(GND) L160.3-GND(GND) L161.3-GND(GND) L162.3-GND(GND) L163.3-GND(GND) L164.3-GND(GND) L165.3-GND(GND) L166.3-GND(GND) L167.3-GND(GND) L168.3-GND(GND) L169.3-GND(GND) L170.3-GND(GND) L171.3-GND(GND) L172.3-GND(GND) L173.3-GND(GND) L174.3-GND(GND) L175.3-GND(GND) L176.3-GND(GND) L177.3-GND(GND) L178.3-GND(GND) L179.3-GND(GND) L180.3-GND(GND) L181.3-GND(GND) L182.3-GND(GND) L183.3-GND(GND) L184.3-GND(GND) L185.3-GND(GND) L186.3-GND(GND) L187.3-GND(GND) L188.3-GND(GND) L189.3-GND(GND) L190.3-GND(GND) L191.3-GND(GND) L192.3-GND(GND) L193.3-GND(GND) L194.3-GND(GND) L195.3-GND(GND) L196.3-GND(GND) L197.3-GND(GND) L198.3-GND(GND) L199.3-GND(GND) L200.3-GND(GND) L201.3-GND(GND) L202.3-GND(GND) L203.3-GND(GND) L204.3-GND(GND) L205.3-GND(GND) L206.3-GND(GND) L207.3-GND(GND) L208.3-GND(GND) L209.3-GND(GND) L210.3-GND(GND) L211.3-GND(GND) L212.3-GND(GND) L213.3-GND(GND) L214.3-GND(GND) L215.3-GND(GND) L216.3-GND(GND) L217.3-GND(GND) L218.3-GND(GND) L219.3-GND(GND) L220.3-GND(GND) L221.3-GND(GND) L222.3-GND(GND) L223.3-GND(GND) L224.3-GND(GND) L225.3-GND(GND) L226.3-GND(GND) L227.3-GND(GND) L228.3-GND(GND) L229.3-GND(GND) L230.3-GND(GND) L231.3-GND(GND) L232.3-GND(GND) L233.3-GND(GND) L234.3-GND(GND) L235.3-GND(GND) L236.3-GND(GND) L237.3-GND(GND) L238.3-GND(GND) L239.3-GND(GND) L240.3-GND(GND) L241.3-GND(GND) L242.3-GND(GND) L243.3-GND(GND) L244.3-GND(GND) L245.3-GND(GND) L246.3-GND(GND) L247.3-GND(GND) L248.3-GND(GND) L249.3-GND(GND) L250.3-GND(GND) L251.3-GND(GND) L252.3-GND(GND) L253.3-GND(GND) L254.3-GND(GND) L255.3-GND(GND) L256.3-GND(GND)
N$1: L1.2-DOUT(DOUT) L2.4-DIN(DIN)
N$2: L2.2-DOUT(DOUT) L3.4-DIN(DIN)
N$3: L3.2-DOUT(DOUT) L4.4-DIN(DIN)
N$4: L4.2-DOUT(DOUT) L5.4-DIN(DIN)
N$5: L5.2-DOUT(DOUT) L6.4-DIN(DIN)
N$6: L6.2-DOUT(DOUT) L7.4-DIN(DIN)
N$7: L7.2-DOUT(DOUT) L8.4-DIN(DIN)
N$8: L8.2-DOUT(DOUT) L9.4-DIN(DIN)
N$9: L9.2-DOUT(DOUT) L10.4-DIN(DIN)
N$10: L10.2-DOUT(DOUT) L11.4-DIN(DIN)
N$11: L11.2-DOUT(DOUT) L12.4-DIN(DIN)
N$12: L12.2-DOUT(DOUT) L13.4-DIN(DIN)
N$13: L13.2-DOUT(DOUT) L14.4-DIN(DIN)
N$14: L14.2-DOUT(DOUT) L15.4-DIN(DIN)
N$15: L15.2-DOUT(DOUT) L16.4-DIN(DIN)
N$16: L16.2-DOUT(DOUT) L17.4-DIN(DIN)
N$17: L17.2-DOUT(DOUT) L18.4-DIN(DIN)
N$18: L18.2-DOUT(DOUT) L19.4-DIN(DIN)
N$19: L19.2-DOUT(DOUT) L20.4-DIN(DIN)
N$20: L20.2-DOUT(DOUT) L21.4-DIN(DIN)
N$21: L21.2-DOUT(DOUT) L22.4-DIN(DIN)
N$22: L22.2-DOUT(DOUT) L23.4-DIN(DIN)
N$23: L23.2-DOUT(DOUT) L24.4-DIN(DIN)
N$24: L24.2-DOUT(DOUT) L25.4-DIN(DIN)
N$25: L25.2-DOUT(DOUT) L26.4-DIN(DIN)
N$26: L26.2-DOUT(DOUT) L27.4-DIN(DIN)
N$27: L27.2-DOUT(DOUT) L28.4-DIN(DIN)
N$28: L28.2-DOUT(DOUT) L29.4-DIN(DIN)
N$29: L29.2-DOUT(DOUT) L30.4-DIN(DIN)
N$30: L30.2-DOUT(DOUT) L31.4-DIN(DIN)
N$31: L31.2-DOUT(DOUT) L32.4-DIN(DIN)
N$32: L32.2-DOUT(DOUT) L33.4-DIN(DIN)
N$33: L33.2-DOUT(DOUT) L34.4-DIN(DIN)
N$34: L34.2-DOUT(DOUT) L35.4-DIN(DIN)
N$35: L35.2-DOUT(DOUT) L36.4-DIN(DIN)
N$36: L36.2-DOUT(DOUT) L37.4-DIN(DIN)
N$37: L37.2-DOUT(DOUT) L38.4-DIN(DIN)
N$38: L38.2-DOUT(DOUT) L39.4-DIN(DIN)
N$39: L39.2-DOUT(DOUT) L40.4-DIN(DIN)
N$40: L40.2-DOUT(DOUT) L41.4-DIN(DIN)
N$41: L41.2-DOUT(DOUT) L42.4-DIN(DIN)
N$42: L42.2-DOUT(DOUT) L43.4-DIN(DIN)
N$43: L43.2-DOUT(DOUT) L44.4-DIN(DIN)
N$44: L44.2-DOUT(DOUT) L45.4-DIN(DIN)
N$45: L45.2-DOUT(DOUT) L46.4-DIN(DIN)
N$46: L46.2-DOUT(DOUT) L47.4-DIN(DIN)
N$47: L47.2-DOUT(DOUT) L48.4-DIN(DIN)
N$48: L48.2-DOUT(DOUT) L49.4-DIN(DIN)
N$49: L49.2-DOUT(DOUT) L50.4-DIN(DIN)
N$50: L50.2-DOUT(DOUT) L51.4-DIN(DIN)
N$51: L51.2-DOUT(DOUT) L52.4-DIN(DIN)
N$52: L52.2-DOUT(DOUT) L53.4-DIN(DIN)
N$53: L53.2-DOUT(DOUT) L54.4-DIN(DIN)
N$54: L54.2-DOUT(DOUT) L55.4-DIN(DIN)
N$55: L55.2-DOUT(DOUT) L56.4-DIN(DIN)
N$56: L56.2-DOUT(DOUT) L57.4-DIN(DIN)
N$57: L57.2-DOUT(DOUT) L58.4-DIN(DIN)
N$58: L58.2-DOUT(DOUT) L59.4-DIN(DIN)
N$59: L59.2-DOUT(DOUT) L60.4-DIN(DIN)
N$60: L60.2-DOUT(DOUT) L61.4-DIN(DIN)
N$61: L61.2-DOUT(DOUT) L62.4-DIN(DIN)
N$62: L62.2-DOUT(DOUT) L63.4-DIN(DIN)
N$63: L63.2-DOUT(DOUT) L64.4-DIN(DIN)
N$64: L65.2-DOUT(DOUT) L66.4-DIN(DIN)
N$65: L66.2-DOUT(DOUT) L67.4-DIN(DIN)
N$66: L67.2-DOUT(DOUT) L68.4-DIN(DIN)
N$67: L68.2-DOUT(DOUT) L69.4-DIN(DIN)
N$68: L69.2-DOUT(DOUT) L70.4-DIN(DIN)
N$69: L70.2-DOUT(DOUT) L71.4-DIN(DIN)
N$70: L71.2-DOUT(DOUT) L72.4-DIN(DIN)
N$71: L72.2-DOUT(DOUT) L73.4-DIN(DIN)
N$72: L73.2-DOUT(DOUT) L74.4-DIN(DIN)
N$73: L74.2-DOUT(DOUT) L75.4-DIN(DIN)
N$74: L75.2-DOUT(DOUT) L76.4-DIN(DIN)
N$75: L76.2-DOUT(DOUT) L77.4-DIN(DIN)
N$76: L77.2-DOUT(DOUT) L78.4-DIN(DIN)
N$77: L78.2-DOUT(DOUT) L79.4-DIN(DIN)
N$78: L79.2-DOUT(DOUT) L80.4-DIN(DIN)
N$79: L80.2-DOUT(DOUT) L81.4-DIN(DIN)
N$80: L81.2-DOUT(DOUT) L82.4-DIN(DIN)
N$81: L82.2-DOUT(DOUT) L83.4-DIN(DIN)
N$82: L83.2-DOUT(DOUT) L84.4-DIN(DIN)
N$83: L84.2-DOUT(DOUT) L85.4-DIN(DIN)
N$84: L85.2-DOUT(DOUT) L86.4-DIN(DIN)
N$85: L86.2-DOUT(DOUT) L87.4-DIN(DIN)
N$86: L87.2-DOUT(DOUT) L88.4-DIN(DIN)
N$87: L88.2-DOUT(DOUT) L89.4-DIN(DIN)
N$88: L89.2-DOUT(DOUT) L90.4-DIN(DIN)
N$89: L90.2-DOUT(DOUT) L91.4-DIN(DIN)
N$90: L91.2-DOUT(DOUT) L92.4-DIN(DIN)
N$91: L92.2-DOUT(DOUT) L93.4-DIN(DIN)
N$92: L93.2-DOUT(DOUT) L94.4-DIN(DIN)
N$93: L94.2-DOUT(DOUT) L95.4-DIN(DIN)
N$94: L95.2-DOUT(DOUT) L96.4-DIN(DIN)
N$95: L96.2-DOUT(DOUT) L97.4-DIN(DIN)
N$96: L97.2-DOUT(DOUT) L98.4-DIN(DIN)
N$97: L98.2-DOUT(DOUT) L99.4-DIN(DIN)
N$98: L99.2-DOUT(DOUT) L100.4-DIN(DIN)
N$99: L100.2-DOUT(DOUT) L101.4-DIN(DIN)
N$100: L101.2-DOUT(DOUT) L102.4-DIN(DIN)
N$101: L102.2-DOUT(DOUT) L103.4-DIN(DIN)
N$102: L103.2-DOUT(DOUT) L104.4-DIN(DIN)
N$103: L104.2-DOUT(DOUT) L105.4-DIN(DIN)
N$104: L105.2-DOUT(DOUT) L106.4-DIN(DIN)
N$105: L106.2-DOUT(DOUT) L107.4-DIN(DIN)
N$106: L107.2-DOUT(DOUT) L108.4-DIN(DIN)
N$107: L108.2-DOUT(DOUT) L109.4-DIN(DIN)
N$108: L109.2-DOUT(DOUT) L110.4-DIN(DIN)
N$109: L110.2-DOUT(DOUT) L111.4-DIN(DIN)
N$110: L111.2-DOUT(DOUT) L112.4-DIN(DIN)
N$111: L112.2-DOUT(DOUT) L113.4-DIN(DIN)
N$112: L113.2-DOUT(DOUT) L114.4-DIN(DIN)
N$113: L114.2-DOUT(DOUT) L115.4-DIN(DIN)
N$114: L115.2-DOUT(DOUT) L116.4-DIN(DIN)
N$115: L116.2-DOUT(DOUT) L117.4-DIN(DIN)
N$116: L117.2-DOUT(DOUT) L118.4-DIN(DIN)
N$117: L118.2-DOUT(DOUT) L119.4-DIN(DIN)
N$118: L119.2-DOUT(DOUT) L120.4-DIN(DIN)
N$119: L120.2-DOUT(DOUT) L121.4-DIN(DIN)
N$120: L121.2-DOUT(DOUT) L122.4-DIN(DIN)
N$121: L122.2-DOUT(DOUT) L123.4-DIN(DIN)
N$122: L123.2-DOUT(DOUT) L124.4-DIN(DIN)
N$123: L124.2-DOUT(DOUT) L125.4-DIN(DIN)
N$124: L125.2-DOUT(DOUT) L126.4-DIN(DIN)
N$125: L126.2-DOUT(DOUT) L127.4-DIN(DIN)
N$126: L127.2-DOUT(DOUT) L128.4-DIN(DIN)
N$127: L129.2-DOUT(DOUT) L130.4-DIN(DIN)
N$128: L130.2-DOUT(DOUT) L131.4-DIN(DIN)
N$129: L131.2-DOUT(DOUT) L132.4-DIN(DIN)
N$130: L132.2-DOUT(DOUT) L133.4-DIN(DIN)
N$131: L133.2-DOUT(DOUT) L134.4-DIN(DIN)
N$132: L134.2-DOUT(DOUT) L135.4-DIN(DIN)
N$133: L135.2-DOUT(DOUT) L136.4-DIN(DIN)
N$134: L136.2-DOUT(DOUT) L137.4-DIN(DIN)
N$135: L137.2-DOUT(DOUT) L138.4-DIN(DIN)
N$136: L138.2-DOUT(DOUT) L139.4-DIN(DIN)
N$137: L139.2-DOUT(DOUT) L140.4-DIN(DIN)
N$138: L140.2-DOUT(DOUT) L141.4-DIN(DIN)
N$139: L141.2-DOUT(DOUT) L142.4-DIN(DIN)
N$140: L142.2-DOUT(DOUT) L143.4-DIN(DIN)
N$141: L143.2-DOUT(DOUT) L144.4-DIN(DIN)
N$142: L144.2-DOUT(DOUT) L145.4-DIN(DIN)
N$143: L145.2-DOUT(DOUT) L146.4-DIN(DIN)
N$144: L146.2-DOUT(DOUT) L147.4-DIN(DIN)
N$145: L147.2-DOUT(DOUT) L148.4-DIN(DIN)
N$146: L148.2-DOUT(DOUT) L149.4-DIN(DIN)
N$147: L149.2-DOUT(DOUT) L150.4-DIN(DIN)
N$148: L150.2-DOUT(DOUT) L151.4-DIN(DIN)
N$149: L151.2-DOUT(DOUT) L152.4-DIN(DIN)
N$150: L152.2-DOUT(DOUT) L153.4-DIN(DIN)
N$151: L153.2-DOUT(DOUT) L154.4-DIN(DIN)
N$152: L154.2-DOUT(DOUT) L155.4-DIN(DIN)
N$153: L155.2-DOUT(DOUT) L156.4-DIN(DIN)
N$154: L156.2-DOUT(DOUT) L157.4-DIN(DIN)
N$155: L157.2-DOUT(DOUT) L158.4-DIN(DIN)
N$156: L158.2-DOUT(DOUT) L159.4-DIN(DIN)
N$157: L159.2-DOUT(DOUT) L160.4-DIN(DIN)
N$158: L160.2-DOUT(DOUT) L161.4-DIN(DIN)
N$159: L161.2-DOUT(DOUT) L162.4-DIN(DIN)
N$160: L162.2-DOUT(DOUT) L163.4-DIN(DIN)
N$161: L163.2-DOUT(DOUT) L164.4-DIN(DIN)
N$162: L164.2-DOUT(DOUT) L165.4-DIN(DIN)
N$163: L165.2-DOUT(DOUT) L166.4-DIN(DIN)
N$164: L166.2-DOUT(DOUT) L167.4-DIN(DIN)
N$165: L167.2-DOUT(DOUT) L168.4-DIN(DIN)
N$166: L168.2-DOUT(DOUT) L169.4-DIN(DIN)
N$167: L169.2-DOUT(DOUT) L170.4-DIN(DIN)
N$168: L170.2-DOUT(DOUT) L171.4-DIN(DIN)
N$169: L171.2-DOUT(DOUT) L172.4-DIN(DIN)
N$170: L172.2-DOUT(DOUT) L173.4-DIN(DIN)
N$171: L173.2-DOUT(DOUT) L174.4-DIN(DIN)
N$172: L174.2-DOUT(DOUT) L175.4-DIN(DIN)
N$173: L175.2-DOUT(DOUT) L176.4-DIN(DIN)
N$174: L176.2-DOUT(DOUT) L177.4-DIN(DIN)
N$175: L177.2-DOUT(DOUT) L178.4-DIN(DIN)
N$176: L178.2-DOUT(DOUT) L179.4-DIN(DIN)
N$177: L179.2-DOUT(DOUT) L180.4-DIN(DIN)
N$178: L180.2-DOUT(DOUT) L181.4-DIN(DIN)
N$179: L181.2-DOUT(DOUT) L182.4-DIN(DIN)
N$180: L182.2-DOUT(DOUT) L183.4-DIN(DIN)
N$181: L183.2-DOUT(DOUT) L184.4-DIN(DIN)
N$182: L184.2-DOUT(DOUT) L185.4-DIN(DIN)
N$183: L185.2-DOUT(DOUT) L186.4-DIN(DIN)
N$184: L186.2-DOUT(DOUT) L187.4-DIN(DIN)
N$185: L187.2-DOUT(DOUT) L188.4-DIN(DIN)
N$186: L188.2-DOUT(DOUT) L189.4-DIN(DIN)
N$187: L189.2-DOUT(DOUT) L190.4-DIN(DIN)
N$188: L190.2-DOUT(DOUT) L191.4-DIN(DIN)
N$189: L191.2-DOUT(DOUT) L192.4-DIN(DIN)
N$190: L193.2-DOUT(DOUT) L194.4-DIN(DIN)
N$191: L194.2-DOUT(DOUT) L195.4-DIN(DIN)
N$192: L195.2-DOUT(DOUT) L196.4-DIN(DIN)
N$193: L196.2-DOUT(DOUT) L197.4-DIN(DIN)
N$194: L197.2-DOUT(DOUT) L198.4-DIN(DIN)
N$195: L198.2-DOUT(DOUT) L199.4-DIN(DIN)
N$196: L199.2-DOUT(DOUT) L200.4-DIN(DIN)
N$197: L200.2-DOUT(DOUT) L201.4-DIN(DIN)
N$198: L201.2-DOUT(DOUT) L202.4-DIN(DIN)
N$199: L202.2-DOUT(DOUT) L203.4-DIN(DIN)
N$200: L203.2-DOUT(DOUT) L204.4-DIN(DIN)
N$201: L204.2-DOUT(DOUT) L205.4-DIN(DIN)
N$202: L205.2-DOUT(DOUT) L206.4-DIN(DIN)
N$203: L206.2-DOUT(DOUT) L207.4-DIN(DIN)
N$204: L207.2-DOUT(DOUT) L208.4-DIN(DIN)
N$205: L208.2-DOUT(DOUT) L209.4-DIN(DIN)
N$206: L209.2-DOUT(DOUT) L210.4-DIN(DIN)
N$207: L210.2-DOUT(DOUT) L211.4-DIN(DIN)
N$208: L211.2-DOUT(DOUT) L212.4-DIN(DIN)
N$209: L212.2-DOUT(DOUT) L213.4-DIN(DIN)
N$210: L213.2-DOUT(DOUT) L214.4-DIN(DIN)
N$211: L214.2-DOUT(DOUT) L215.4-DIN(DIN)
N$212: L215.2-DOUT(DOUT) L216.4-DIN(DIN)
N$213: L216.2-DOUT(DOUT) L217.4-DIN(DIN)
N$214: L217.2-DOUT(DOUT) L218.4-DIN(DIN)
N$215: L218.2-DOUT(DOUT) L219.4-DIN(DIN)
N$216: L219.2-DOUT(DOUT) L220.4-DIN(DIN)
N$217: L220.2-DOUT(DOUT) L221.4-DIN(DIN)
N$218: L221.2-DOUT(DOUT) L222.4-DIN(DIN)
N$219: L222.2-DOUT(DOUT) L223.4-DIN(DIN)
N$220: L223.2-DOUT(DOUT) L224.4-DIN(DIN)
N$221: L224.2-DOUT(DOUT) L225.4-DIN(DIN)
N$222: L225.2-DOUT(DOUT) L226.4-DIN(DIN)
N$223: L226.2-DOUT(DOUT) L227.4-DIN(DIN)
N$224: L227.2-DOUT(DOUT) L228.4-DIN(DIN)
N$225: L228.2-DOUT(DOUT) L229.4-DIN(DIN)
N$226: L229.2-DOUT(DOUT) L230.4-DIN(DIN)
N$227: L230.2-DOUT(DOUT) L231.4-DIN(DIN)
N$228: L231.2-DOUT(DOUT) L232.4-DIN(DIN)
N$229: L232.2-DOUT(DOUT) L233.4-DIN(DIN)
N$230: L233.2-DOUT(DOUT) L234.4-DIN(DIN)
N$231: L234.2-DOUT(DOUT) L235.4-DIN(DIN)
N$232: L235.2-DOUT(DOUT) L236.4-DIN(DIN)
N$233: L236.2-DOUT(DOUT) L237.4-DIN(DIN)
N$234: L237.2-DOUT(DOUT) L238.4-DIN(DIN)
N$235: L238.2-DOUT(DOUT) L239.4-DIN(DIN)
N$236: L239.2-DOUT(DOUT) L240.4-DIN(DIN)
N$237: L240.2-DOUT(DOUT) L241.4-DIN(DIN)
N$238: L241.2-DOUT(DOUT) L242.4-DIN(DIN)
N$239: L242.2-DOUT(DOUT) L243.4-DIN(DIN)
N$240: L243.2-DOUT(DOUT) L244.4-DIN(DIN)
N$241: L244.2-DOUT(DOUT) L245.4-DIN(DIN)
N$242: L245.2-DOUT(DOUT) L246.4-DIN(DIN)
N$243: L246.2-DOUT(DOUT) L247.4-DIN(DIN)
N$244: L247.2-DOUT(DOUT) L248.4-DIN(DIN)
N$245: L248.2-DOUT(DOUT) L249.4-DIN(DIN)
N$246: L249.2-DOUT(DOUT) L250.4-DIN(DIN)
N$247: L250.2-DOUT(DOUT) L251.4-DIN(DIN)
N$248: L251.2-DOUT(DOUT) L252.4-DIN(DIN)
N$249: L252.2-DOUT(DOUT) L253.4-DIN(DIN)
N$250: L253.2-DOUT(DOUT) L254.4-DIN(DIN)
N$251: L254.2-DOUT(DOUT) L255.4-DIN(DIN)
N$252: L255.2-DOUT(DOUT) L256.4-DIN(DIN)
N$253: L1.4-DIN(DIN) R4.2
N$254: L65.4-DIN(DIN) R5.2
N$255: L193.4-DIN(DIN) R2.2
N$256: L129.4-DIN(DIN) R3.2
N$257: JP1.6 R2.1
N$258: JP1.5 R3.1
N$259: JP1.4 R5.1
N$260: JP1.3 R4.1
VCC: C1.1 C2.1 C3.1 C4.1 C5.1 C6.1 C7.1 C8.1 C9.1 C10.1 C11.1 C12.1 C13.1 C14.1 C15.1 C16.1 C17.1 C18.1 C19.1 C20.1 C21.1 C22.1 C23.1 C24.1 C25.1 C26.1 C27.1 C28.1 C29.1 C30.1 C31.1 C32.1 C33.1 C34.1 C35.1 C36.1 C37.1 C38.1 C39.1 C40.1 C41.1 C42.1 C43.1 C44.1 C45.1 C46.1 C47.1 C48.1 C49.1 C50.1 C51.1 C52.1 C53.1 C54.1 C55.1 C56.1 C57.1 C58.1 C59.1 C60.1 C61.1 C62.1 C63.1 C64.1 C65.1 C66.1 C67.1 C68.1 C69.1 C70.1 C71.1 C72.1 C73.1 C74.1 C75.1 C76.1 C77.1 C78.1 C79.1 C80.1 C81.1 C82.1 C83.1 C84.1 C85.1 C86.1 C87.1 C88.1 C89.1 C90.1 C91.1 C92.1 C93.1 C94.1 C95.1 C96.1 C97.1 C98.1 C99.1 C100.1 C101.1 C102.1 C103.1 C104.1 C105.1 C106.1 C107.1 C108.1 C109.1 C110.1 C111.1 C112.1 C113.1 C114.1 C115.1 C116.1 C117.1 C118.1 C119.1 C120.1 C121.1 C122.1 C123.1 C124.1 C125.1 C126.1 C127.1 C128.1 C129.1 C130.1 C131.1 C132.1 C133.1 C134.1 C135.1 C136.1 C137.1 C138.1 C139.1 C140.1 C141.1 C142.1 C143.1 C144.1 C145.1 C146.1 C147.1 C148.1 C149.1 C150.1 C151.1 C152.1 C153.1 C154.1 C155.1 C156.1 C157.1 C158.1 C159.1 C160.1 C161.1 C162.1 C163.1 C164.1 C165.1 C166.1 C167.1 C168.1 C169.1 C170.1 C171.1 C172.1 C173.1 C174.1 C175.1 C176.1 C177.1 C178.1 C179.1 C180.1 C181.1 C182.1 C183.1 C184.1 C185.1 C186.1 C187.1 C188.1 C189.1 C190.1 C191.1 C192.1 C193.1 C194.1 C195.1 C196.1 C197.1 C198.1 C199.1 C200.1 C201.1 C202.1 C203.1 C204.1 C205.1 C206.1 C207.1 C208.1 C209.1 C210.1 C211.1 C212.1 C213.1 C214.1 C215.1 C216.1 C217.1 C218.1 C219.1 C220.1 C221.1 C222.1 C223.1 C224.1 C225.1 C226.1 C227.1 C228.1 C229.1 C230.1 C231.1 C232.1 C233.1 C234.1 C235.1 C236.1 C237.1 C238.1 C239.1 C240.1 C241.1 C242.1 C243.1 C244.1 C245.1 C246.1 C247.1 C248.1 C249.1 C250.1 C251.1 C252.1 C253.1 C254.1 C255.1 C256.1 JP1.1 L1.1-VDD(VDD) L2.1-VDD(VDD) L3.1-VDD(VDD) L4.1-VDD(VDD) L5.1-VDD(VDD) L6.1-VDD(VDD) L7.1-VDD(VDD) L8.1-VDD(VDD) L9.1-VDD(VDD) L10.1-VDD(VDD) L11.1-VDD(VDD) L12.1-VDD(VDD) L13.1-VDD(VDD) L14.1-VDD(VDD) L15.1-VDD(VDD) L16.1-VDD(VDD) L17.1-VDD(VDD) L18.1-VDD(VDD) L19.1-VDD(VDD) L20.1-VDD(VDD) L21.1-VDD(VDD) L22.1-VDD(VDD) L23.1-VDD(VDD) L24.1-VDD(VDD) L25.1-VDD(VDD) L26.1-VDD(VDD) L27.1-VDD(VDD) L28.1-VDD(VDD) L29.1-VDD(VDD) L30.1-VDD(VDD) L31.1-VDD(VDD) L32.1-VDD(VDD) L33.1-VDD(VDD) L34.1-VDD(VDD) L35.1-VDD(VDD) L36.1-VDD(VDD) L37.1-VDD(VDD) L38.1-VDD(VDD) L39.1-VDD(VDD) L40.1-VDD(VDD) L41.1-VDD(VDD) L42.1-VDD(VDD) L43.1-VDD(VDD) L44.1-VDD(VDD) L45.1-VDD(VDD) L46.1-VDD(VDD) L47.1-VDD(VDD) L48.1-VDD(VDD) L49.1-VDD(VDD) L50.1-VDD(VDD) L51.1-VDD(VDD) L52.1-VDD(VDD) L53.1-VDD(VDD) L54.1-VDD(VDD) L55.1-VDD(VDD) L56.1-VDD(VDD) L57.1-VDD(VDD) L58.1-VDD(VDD) L59.1-VDD(VDD) L60.1-VDD(VDD) L61.1-VDD(VDD) L62.1-VDD(VDD) L63.1-VDD(VDD) L64.1-VDD(VDD) L65.1-VDD(VDD) L66.1-VDD(VDD) L67.1-VDD(VDD) L68.1-VDD(VDD) L69.1-VDD(VDD) L70.1-VDD(VDD) L71.1-VDD(VDD) L72.1-VDD(VDD) L73.1-VDD(VDD) L74.1-VDD(VDD) L75.1-VDD(VDD) L76.1-VDD(VDD) L77.1-VDD(VDD) L78.1-VDD(VDD) L79.1-VDD(VDD) L80.1-VDD(VDD) L81.1-VDD(VDD) L82.1-VDD(VDD) L83.1-VDD(VDD) L84.1-VDD(VDD) L85.1-VDD(VDD) L86.1-VDD(VDD) L87.1-VDD(VDD) L88.1-VDD(VDD) L89.1-VDD(VDD) L90.1-VDD(VDD) L91.1-VDD(VDD) L92.1-VDD(VDD) L93.1-VDD(VDD) L94.1-VDD(VDD) L95.1-VDD(VDD) L96.1-VDD(VDD) L97.1-VDD(VDD) L98.1-VDD(VDD) L99.1-VDD(VDD) L100.1-VDD(VDD) L101.1-VDD(VDD) L102.1-VDD(VDD) L103.1-VDD(VDD) L104.1-VDD(VDD) L105.1-VDD(VDD) L106.1-VDD(VDD) L107.1-VDD(VDD) L108.1-VDD(VDD) L109.1-VDD(VDD) L110.1-VDD(VDD) L111.1-VDD(VDD) L112.1-VDD(VDD) L113.1-VDD(VDD) L114.1-VDD(VDD) L115.1-VDD(VDD) L116.1-VDD(VDD) L117.1-VDD(VDD) L118.1-VDD(VDD) L119.1-VDD(VDD) L120.1-VDD(VDD) L121.1-VDD(VDD) L122.1-VDD(VDD) L123.1-VDD(VDD) L124.1-VDD(VDD) L125.1-VDD(VDD) L126.1-VDD(VDD) L127.1-VDD(VDD) L128.1-VDD(VDD) L129.1-VDD(VDD) L130.1-VDD(VDD) L131.1-VDD(VDD) L132.1-VDD(VDD) L133.1-VDD(VDD) L134.1-VDD(VDD) L135.1-VDD(VDD) L136.1-VDD(VDD) L137.1-VDD(VDD) L138.1-VDD(VDD) L139.1-VDD(VDD) L140.1-VDD(VDD) L141.1-VDD(VDD) L142.1-VDD(VDD) L143.1-VDD(VDD) L144.1-VDD(VDD) L145.1-VDD(VDD) L146.1-VDD(VDD) L147.1-VDD(VDD) L148.1-VDD(VDD) L149.1-VDD(VDD) L150.1-VDD(VDD) L151.1-VDD(VDD) L152.1-VDD(VDD) L153.1-VDD(VDD) L154.1-VDD(VDD) L155.1-VDD(VDD) L156.1-VDD(VDD) L157.1-VDD(VDD) L158.1-VDD(VDD) L159.1-VDD(VDD) L160.1-VDD(VDD) L161.1-VDD(VDD) L162.1-VDD(VDD) L163.1-VDD(VDD) L164.1-VDD(VDD) L165.1-VDD(VDD) L166.1-VDD(VDD) L167.1-VDD(VDD) L168.1-VDD(VDD) L169.1-VDD(VDD) L170.1-VDD(VDD) L171.1-VDD(VDD) L172.1-VDD(VDD) L173.1-VDD(VDD) L174.1-VDD(VDD) L175.1-VDD(VDD) L176.1-VDD(VDD) L177.1-VDD(VDD) L178.1-VDD(VDD) L179.1-VDD(VDD) L180.1-VDD(VDD) L181.1-VDD(VDD) L182.1-VDD(VDD) L183.1-VDD(VDD) L184.1-VDD(VDD) L185.1-VDD(VDD) L186.1-VDD(VDD) L187.1-VDD(VDD) L188.1-VDD(VDD) L189.1-VDD(VDD) L190.1-VDD(VDD) L191.1-VDD(VDD) L192.1-VDD(VDD) L193.1-VDD(VDD) L194.1-VDD(VDD) L195.1-VDD(VDD) L196.1-VDD(VDD) L197.1-VDD(VDD) L198.1-VDD(VDD) L199.1-VDD(VDD) L200.1-VDD(VDD) L201.1-VDD(VDD) L202.1-VDD(VDD) L203.1-VDD(VDD) L204.1-VDD(VDD) L205.1-VDD(VDD) L206.1-VDD(VDD) L207.1-VDD(VDD) L208.1-VDD(VDD) L209.1-VDD(VDD) L210.1-VDD(VDD) L211.1-VDD(VDD) L212.1-VDD(VDD) L213.1-VDD(VDD) L214.1-VDD(VDD) L215.1-VDD(VDD) L216.1-VDD(VDD) L217.1-VDD(VDD) L218.1-VDD(VDD) L219.1-VDD(VDD) L220.1-VDD(VDD) L221.1-VDD(VDD) L222.1-VDD(VDD) L223.1-VDD(VDD) L224.1-VDD(VDD) L225.1-VDD(VDD) L226.1-VDD(VDD) L227.1-VDD(VDD) L228.1-VDD(VDD) L229.1-VDD(VDD) L230.1-VDD(VDD) L231.1-VDD(VDD) L232.1-VDD(VDD) L233.1-VDD(VDD) L234.1-VDD(VDD) L235.1-VDD(VDD) L236.1-VDD(VDD) L237.1-VDD(VDD) L238.1-VDD(VDD) L239.1-VDD(VDD) L240.1-VDD(VDD) L241.1-VDD(VDD) L242.1-VDD(VDD) L243.1-VDD(VDD) L244.1-VDD(VDD) L245.1-VDD(VDD) L246.1-VDD(VDD) L247.1-VDD(VDD) L248.1-VDD(VDD) L249.1-VDD(VDD) L250.1-VDD(VDD) L251.1-VDD(VDD) L252.1-VDD(VDD) L253.1-VDD(VDD) L254.1-VDD(VDD) L255.1-VDD(VDD) L256.1-VDD(VDD)
Unconnected: L64.2-DOUT(DOUT) L128.2-DOUT(DOUT) L192.2-DOUT(DOUT) L256.2-DOUT(DOUT)

## Library data of the parts
C1-C256 = SparkFun-Capacitors:CAP: Capacitor Standard 0603 ceramic capacitor, and 0.1" leaded capacitor.
JP1 = SparkFun-Connectors:M06: Header 6 Standard 6-pin 0.1" header. Use with straight break away headers (SKU : PRT-00116), right angle break away headers (PRT-00553), swiss pins (PRT-00743), machine pins (PRT-00117), and female headers (PRT-00115). Molex polarized connector foot print use with SKU : PRT-08094 with associated crimp pins and housings. NOTES ON THE VARIANTS LOCK and LOCK_LONGPADS... This footprint was designed to help hold the alignment of a through-hole component (i.e. 6-pin header) while soldering it into place. You may notice that each hole has been shifted either up or down by 0.005 of an inch from it's more standard position (which is a perfectly straight line). This slight alteration caused the pins (the squares in the middle) to touch the edges of the holes. Because they are alternating, it causes a "brace" to hold the component in place. 0.005 has proven to be the perfect amount of "off-center" position when using our standard breakaway headers. Although looks a little odd when you look at the bare footprint, once you have a header in there, the alteration is very hard to notice. Also,if you push a header all the way into place, it is covered up entirely on the bottom side. This idea of altering the position of holes to aid alignment will be further integrated into the Sparkfun Library for other footprints. It can help hold any component with 3 or more connection pins.
L1-L256 = adafruit:WS2812B
R2-R5 = SparkFun-Resistors:RESISTOR: Resistor Basic schematic elements and footprints for 0603, 1206, and PTH resistors.